# EAGLE design PCM2704_Test_v1B (EAGLE 6.4)
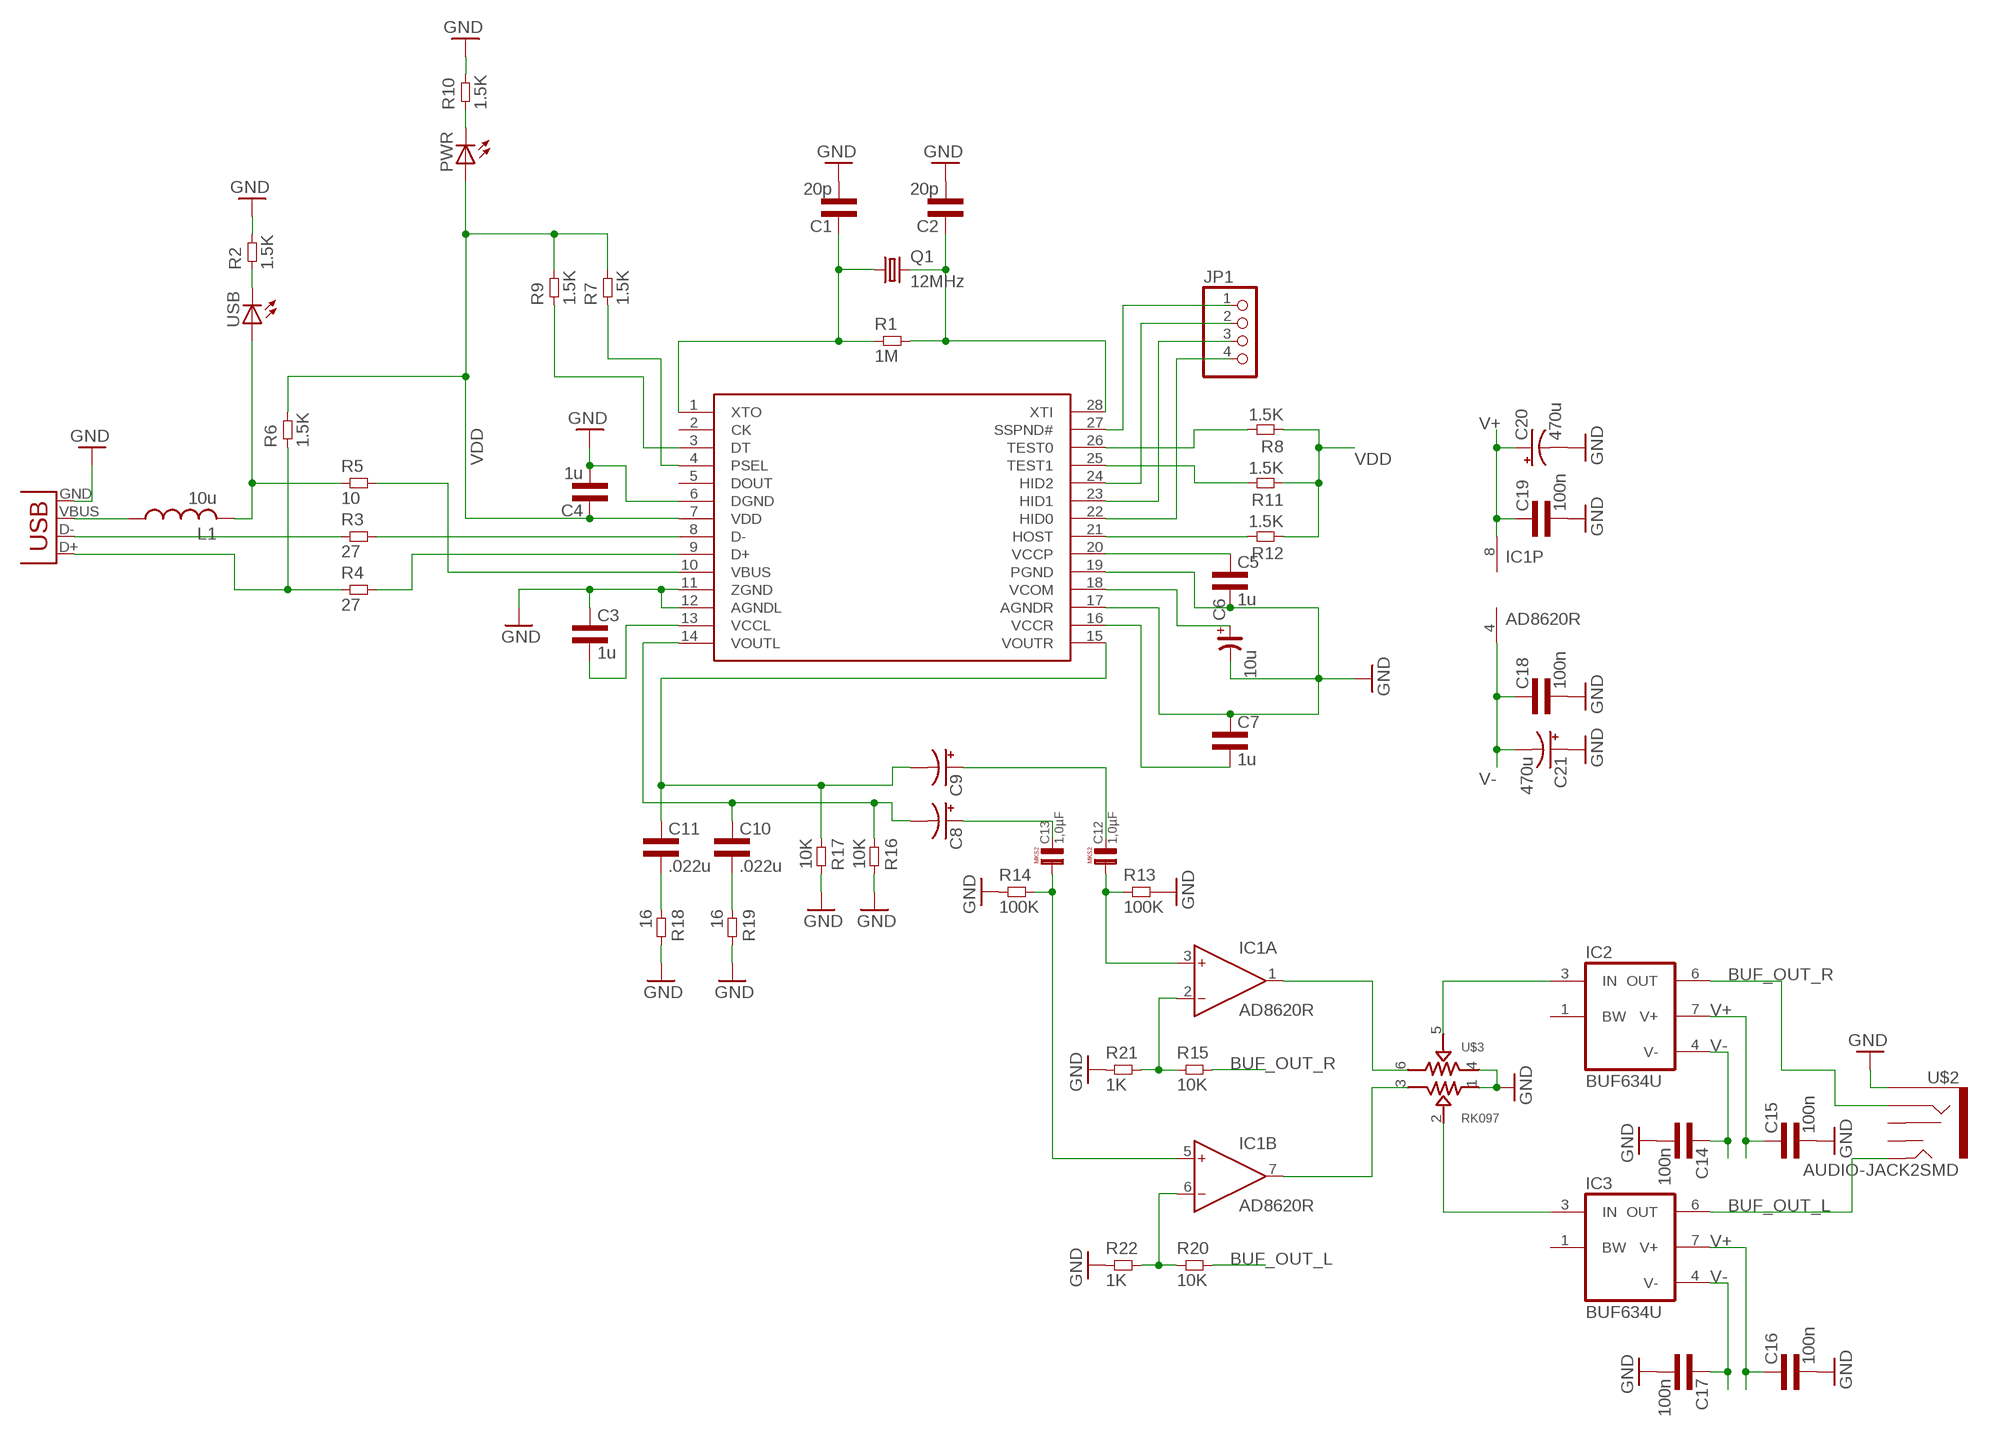
[diagram p0: schematic, sheet 1]

## Parts
C1  20p  CAP0603L3  [0603L3]
C2  20p  CAP0603L3  [0603L3]
C3  1u  CAP0603L3  [0603L3]
C4  1u  CAP0603L3  [0603L3]
C5  1u  CAP0603L3  [0603L3]
C6  10u  CP_E-010X030  [CE-010X030]
C7  1u  CAP0603L3  [0603L3]
C8  CPOL-USE1.8-4  [E1,8-4]
C9  CPOL-USE1.8-4  [E1,8-4]
C10  .022u  CAP0603L3  [0603L3]
C11  .022u  CAP0603L3  [0603L3]
C12  1,0µF  [R5B5]
C13  1,0µF  [R5B5]
C14  100n  CAP0603L3  [0603L3]
C15  100n  CAP0603L3  [0603L3]
C16  100n  CAP0603L3  [0603L3]
C17  100n  CAP0603L3  [0603L3]
C18  100n  CAP0603L3  [0603L3]
C19  100n  CAP0603L3  [0603L3]
C20  470u  CPOL-USE5-13  [E5-13]
C21  470u  CPOL-USE5-13  [E5-13]
IC1  AD8620R  [SO8]
IC2  BUF634U  [SO08]
IC3  BUF634U  [SO08]
JP1  PINHD-1X4  [1X04]
L1  10u  L-USL3225M  [L3225M]
PWR  LEDCHIP-LED0603  [CHIP-LED0603]
Q1  12MHz  CRYSTALHC49US  [HC49US]
R1  1M  RES0603L3  [0603L3]
R2  1.5K  RES0603L3  [0603L3]
R3  27  RES0603L3  [0603L3]
R4  27  RES0603L3  [0603L3]
R5  10  RES0805L3  [0805L3]
R6  1.5K  RES0603L3  [0603L3]
R7  1.5K  RES0603L3  [0603L3]
R8  1.5K  RES0603L3  [0603L3]
R9  1.5K  RES0603L3  [0603L3]
R10  1.5K  RES0603L3  [0603L3]
R11  1.5K  RES0603L3  [0603L3]
R12  1.5K  RES0603L3  [0603L3]
R13  100K  RES0603L3  [0603L3]
R14  100K  RES0603L3  [0603L3]
R15  10K  RES0603L3  [0603L3]
R16  10K  RES0603L3  [0603L3]
R17  10K  RES0603L3  [0603L3]
R18  16  RES0603L3  [0603L3]
R19  16  RES0603L3  [0603L3]
R20  10K  RES0603L3  [0603L3]
R21  1K  RES0603L3  [0603L3]
R22  1K  RES0603L3  [0603L3]
U$1  PCM2704C  [PCM2704C]
U$2  AUDIO-JACK2SMD  [AUDIO-JACK-3.5MM-SMD]
U$3  RK097  [RK097]
USB  LEDCHIP-LED0603  [CHIP-LED0603]
X1  USB-MB-S  [USB-MB-S]

## Nets
BUF_OUT_L: IC3.6(OUT) R20.P$2 U$2.TIP
BUF_OUT_R: IC2.6(OUT) R15.P$2 U$2.RING
GND: C1.P$2 C2.P$2 C3.P$1 C4.P$2 C5.P$2 C6.- C7.P$1 C14.P$2 C15.P$2 C16.P$2 C17.P$2 C18.P$2 C19.P$2 C20.- C21.+ R2.P$2 R10.P$2 R13.P$2 R14.P$1 R16.P$2 R17.P$2 R18.P$2 R19.P$2 R21.P$1 R22.P$1 U$1.6(DGND) U$1.11(ZGND) U$1.12(AGNDL) U$1.17(AGNDR) U$1.19(PGND) U$2.SLEEVE U$3.1 U$3.4 X1.GND
N$1: C1.P$1 Q1.1 R1.P$1 U$1.1(XTO)
N$2: C2.P$1 Q1.2 R1.P$2 U$1.28(XTI)
N$3: R3.P$2 U$1.8(D-)
N$4: C3.P$2 U$1.13(VCCL)
N$5: R8.P$2 U$1.26(TEST0)
N$6: R4.P$2 U$1.9(D+)
N$7: L1.2 R5.1 USB.A
N$8: R5.2 U$1.10(VBUS)
N$9: R11.P$2 U$1.25(TEST1)
N$10: C9.- C11.P$1 R17.P$1 U$1.15(VOUTR)
N$11: R12.P$2 U$1.21(HOST)
N$12: JP1.1 U$1.27(SSPND#)
N$13: C5.P$1 U$1.20(VCCP)
N$14: C6.+ U$1.18(VCOM)
N$15: C8.+ C13.2
N$16: R9.P$1 U$1.3(DT)
N$17: R2.P$1 USB.C
N$18: C9.+ C12.2
N$19: JP1.2 U$1.24(HID2)
N$20: JP1.3 U$1.23(HID1)
N$21: JP1.4 U$1.22(HID0)
N$22: PWR.C R10.P$1
N$23: C7.P$2 U$1.16(VCCR)
N$24: C8.- C10.P$1 R16.P$1 U$1.14(VOUTL)
N$25: C12.1 IC1.3(A:IN+) R13.P$1
N$26: C13.1 IC1.5(B:IN+) R14.P$2
N$27: C11.P$2 R18.P$1
N$28: C10.P$2 R19.P$1
N$29: IC1.2(A:IN-) R15.P$1 R21.P$2
N$30: IC1.6(B:IN-) R20.P$1 R22.P$2
N$31: IC2.3(IN) U$3.5
N$32: IC3.3(IN) U$3.2
N$33: IC1.1(A:OUT) U$3.6
N$34: IC1.7(B:OUT) U$3.3
PSEL: R7.P$1 U$1.4(PSEL)
USB_D_N: R3.P$1 X1.D-
USB_D_P: R4.P$1 R6.P$1 X1.D+
V+: C15.P$1 C16.P$1 C19.P$1 C20.+ IC1.8(P:V+) IC2.7(V+) IC3.7(V+)
V-: C14.P$1 C17.P$1 C18.P$1 C21.- IC1.4(P:V-) IC2.4(V-) IC3.4(V-)
VBUS_RAW: L1.1 X1.VBUS
VDD: C4.P$1 PWR.A R6.P$2 R7.P$2 R8.P$1 R9.P$2 R11.P$1 R12.P$1 U$1.7(VDD)
Unconnected: IC2.1(BW) IC3.1(BW) U$1.2(CK) U$1.5(DOUT) U$2.RSH U$2.TSH

## Library data of the parts
C1-C5 C7 C10 C11 C14-C19 = common:CAP
C6 = rc-master:CP_: POLARIZED CAP
C8 C9 C20 C21 = rcl:CPOL-US: POLARIZED CAPACITOR, American symbol
C12 C13 = Capacitor-Wima-MKS2-63v:1,0µF
IC1 = analog-devices:AD8620: Precision, Very Low Noise, Low Input Bias Current, Wide Bandwidth JFET Operational Amplifiers Source: http://www.analog.com/static/imported-files/data_sheets/AD8610_8620.pdf; MF: ALTERA CORPORATION; MPN: AD8620ARZ; OC_FARNELL: 9994386; OC_NEWARK: 59K6972
IC2 IC3 = burr-brown:BUF634: 250mA High-Speed Buffer; MF: TEXAS INSTRUMENTS; MPN: BUF634U; OC_FARNELL: 4733617; OC_NEWARK: 27C6567
JP1 = pinhead:PINHD-1X4: PIN HEADER
L1 = rcl:L-US: INDUCTOR, American symbol
PWR USB = adafruit:LED: LED OSRAM: - CHIPLED LG R971, LG N971, LY N971, LG Q971, LY Q971, LO R971, LY R971 LH N974, LH R974 LS Q976, LO Q976, LY Q976 LO Q996 - Hyper CHIPLED LW Q18S LB Q993, LB Q99A, LB R99A - SideLED LS A670, LO A670, LY A670, LG A670, LP A670 LB A673, LV A673, LT A673, LW A673 LH A674 LY A675 LS A676, LA A676, LO A676, LY A676, LW A676 LS A679, LY A679, LG A679 - Hyper Micro SIDELED® LS Y876, LA Y876, LO Y876, LY Y876 LT Y87S - SmartLED LW L88C, LW L88S LB L89C, LB L89S, LG L890 LS L89K, LO L89K, LY L89K LS L896, LA L896, LO L896, LY L896 - TOPLED LS T670, LO T670, LY T670, LG T670, LP T670 LSG T670, LSP T670, LSY T670, LOP T670, LYG T670 LG T671, LOG T671, LSG T671 LB T673, LV T673, LT T673, LW T673 LH T674 LS T676, LA T676, LO T676, LY T676, LB T676, LH T676, LSB T676, LW T676 LB T67C, LV T67C, LT T67C, LS T67K, LO T67K, LY T67K, LW E67C LS E67B, LA E67B, LO E67B, LY E67B, LB E67C, LV E67C, LT E67C LW T67C LS T679, LY T679, LG T679 LS T770, LO T770, LY T770, LG T770, LP T770 LB T773, LV T773, LT T773, LW T773 LH T774 LS E675, LA E675, LY E675, LS T675 LS T776, LA T776, LO T776, LY T776, LB T776 LHGB T686 LT T68C, LB T68C - Hyper Mini TOPLED® LB M676 - Mini TOPLED Santana® LG M470 LS M47K, LO M47K, LY M47K Source: http://www.osram.convergy.de/
Q1 = SparkFun-FreqCtrl:CRYSTAL: Various standard crystals. Proven footprints. Spark Fun Electronics SKU : COM-00534
R1-R22 = common:RES
U$1 = pcm2704c:PCM2704C
U$2 = SparkFun-Connectors:AUDIO-JACK2: Stereo audio jack with bypass switches. Used on LilyPad MP3 board. Production SKU: CONN-10353; PROD_ID: CONN-10353
U$3 = SparkFun-Electromechanical:RK097
X1 = con-usb:USB: USB Connectors

## Board
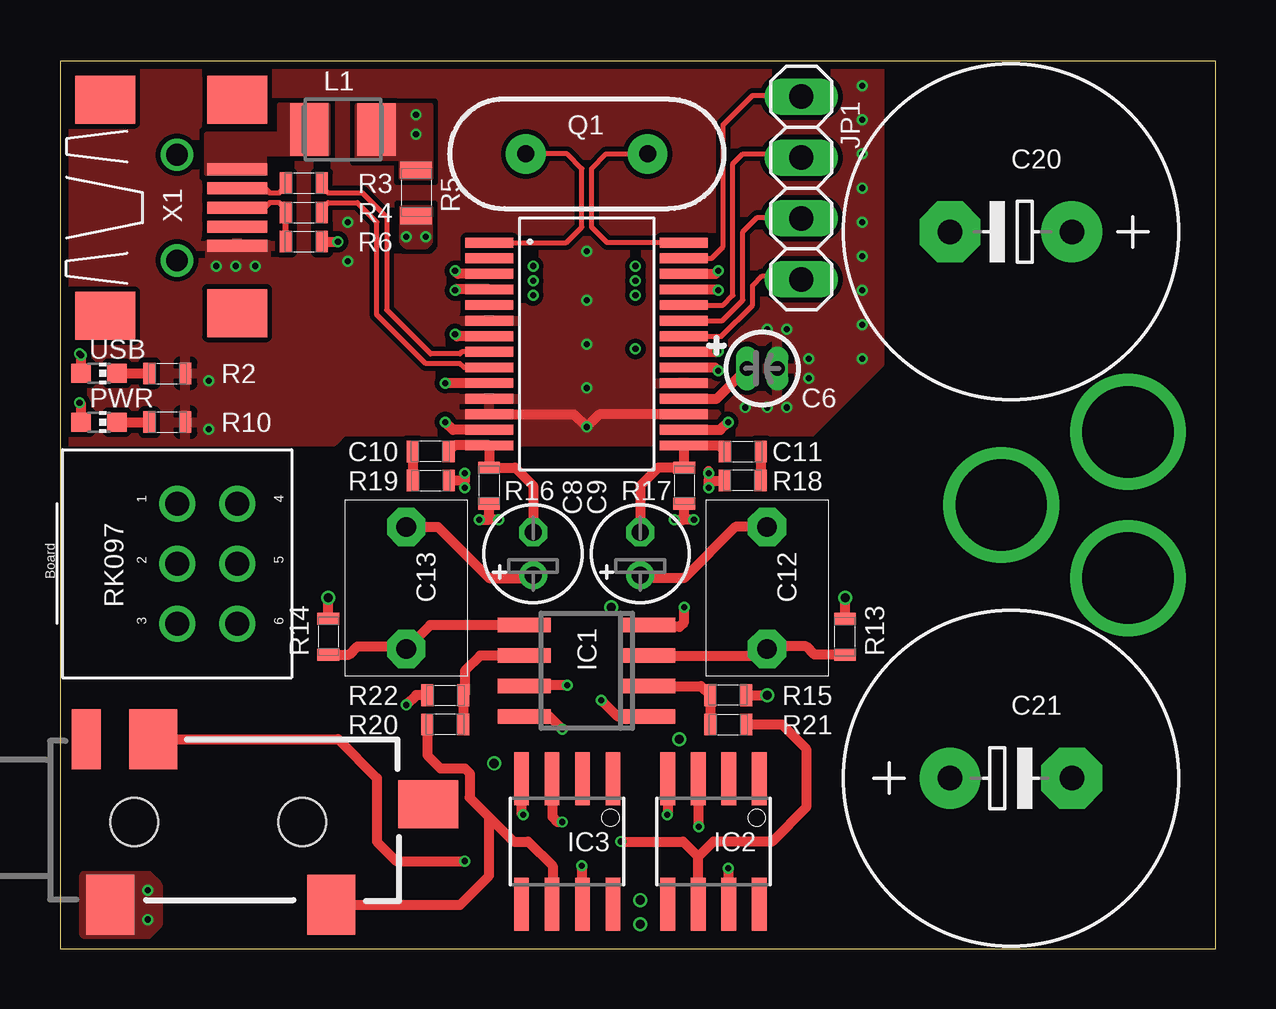
[diagram p1: board, top side]
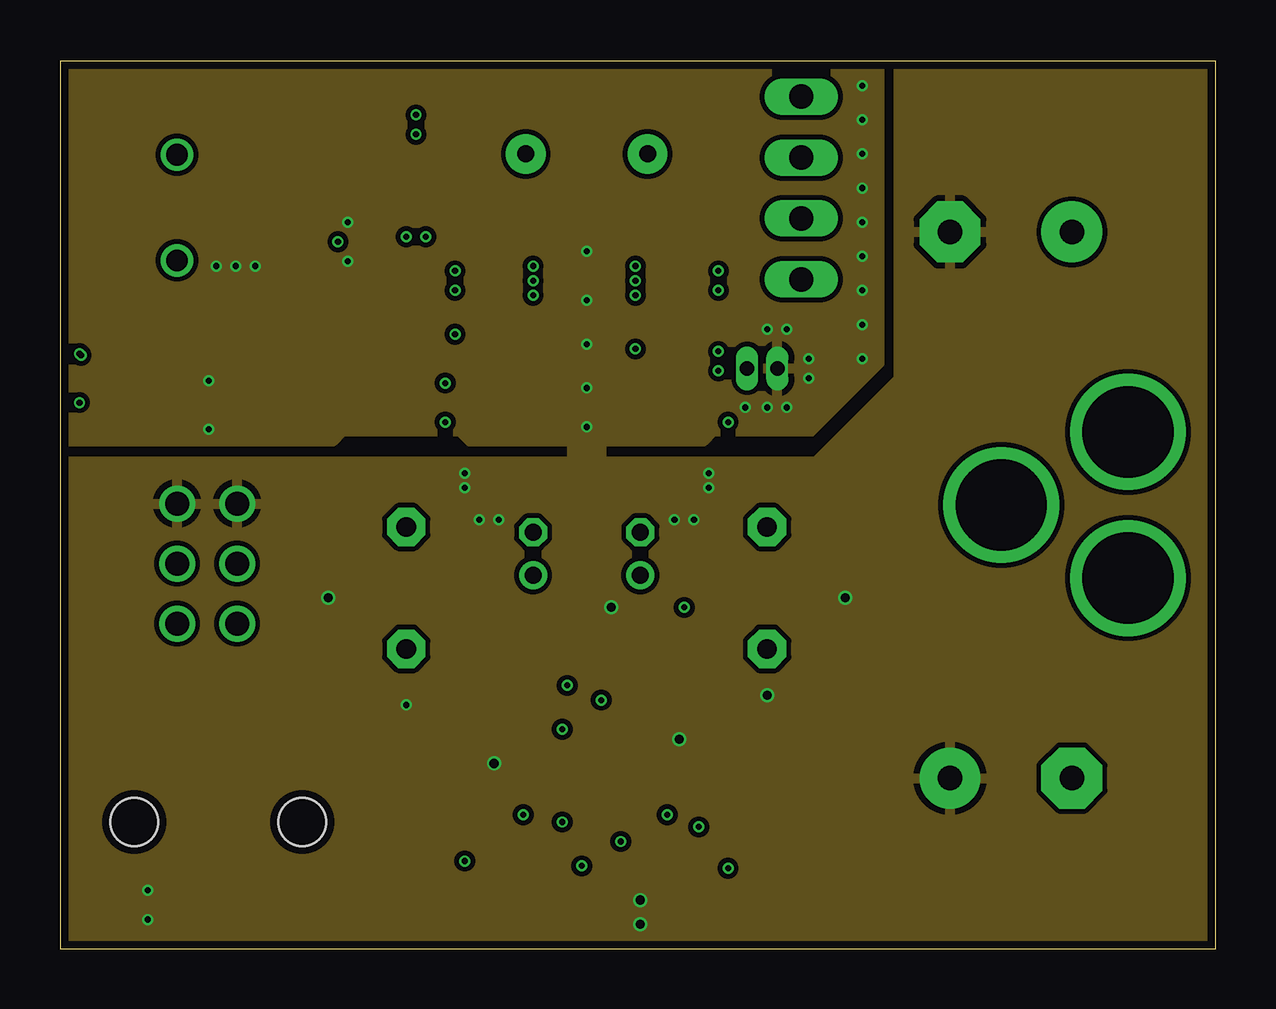
[diagram p2: board, inner layer Route2]
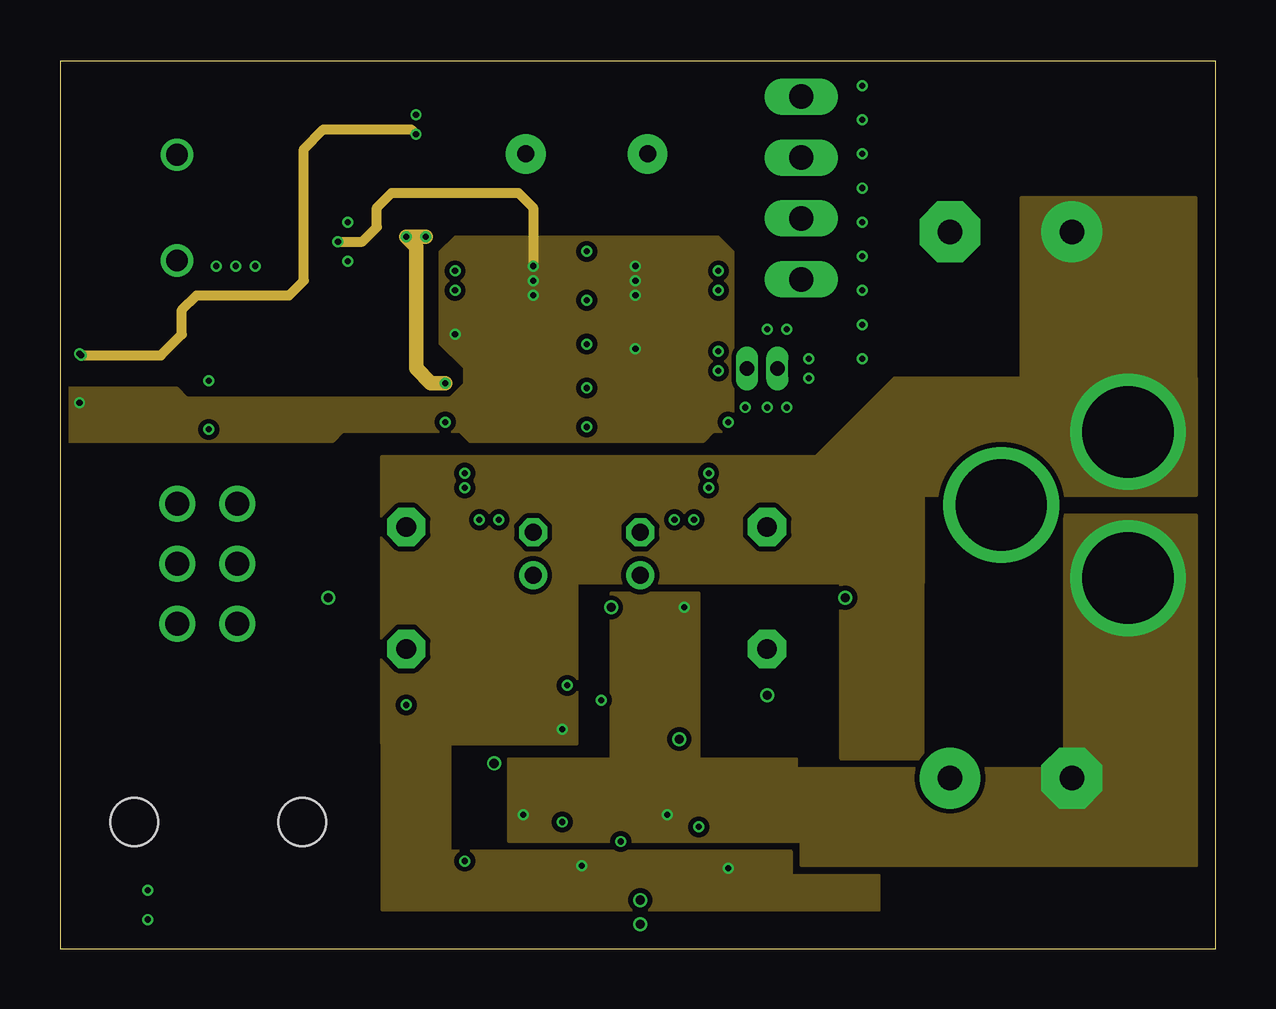
[diagram p3: board, inner layer Route3]
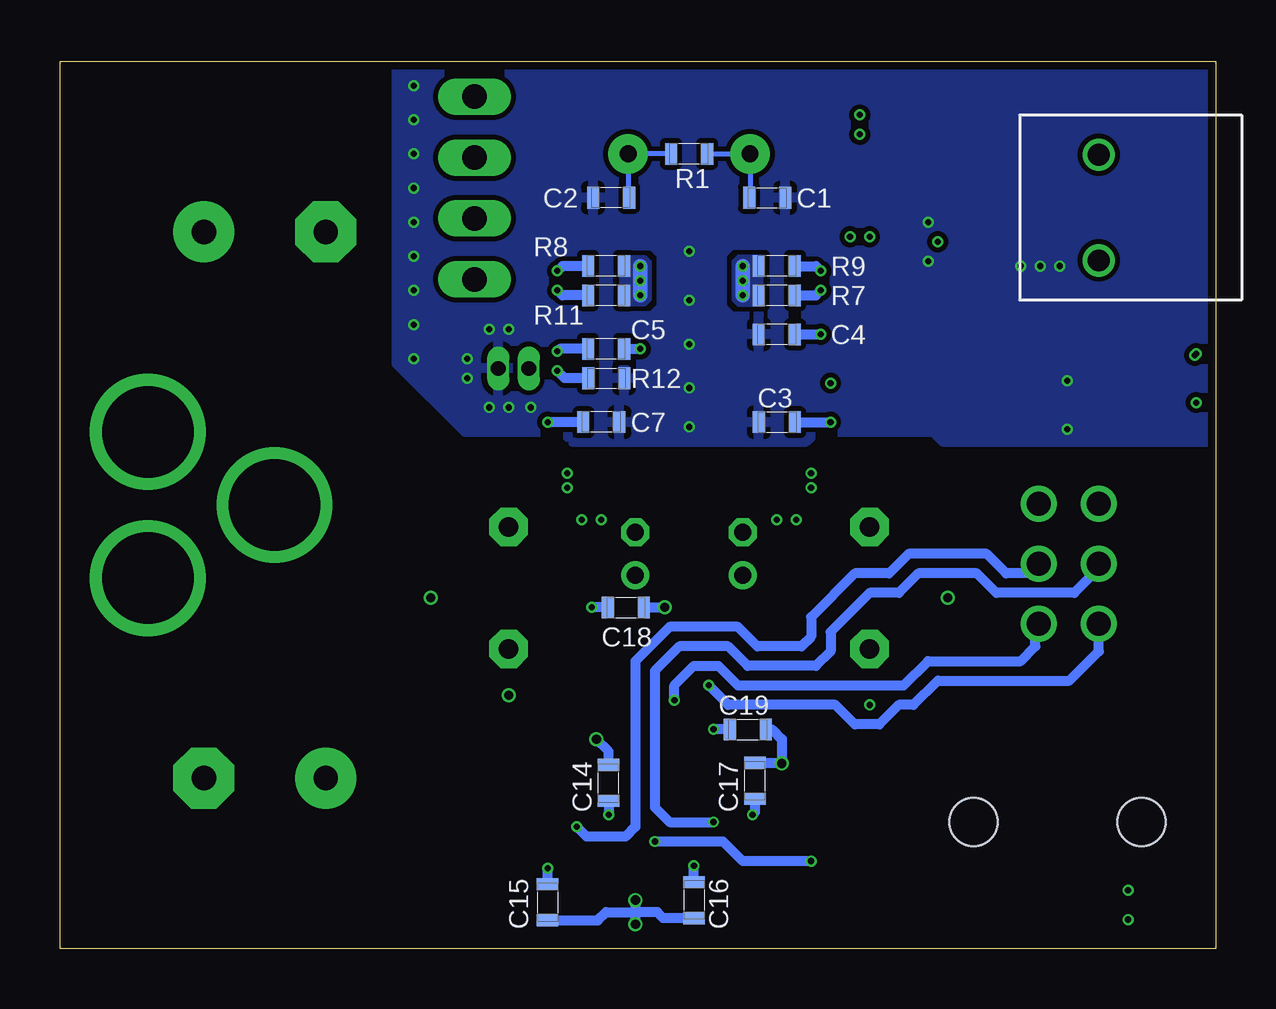
[diagram p4: board, bottom side, seen from below]

Size 48.16 x 36.98 mm. Coordinates in mm from the lower left corner, seen from the top.
Outline: 0,0 48.16,0 48.16,36.98 0,36.98 0,0
Copper layers (1*2*3*16): Top 0.035mm / dielectric 1.5mm / Route2 0.035mm / dielectric 0.15mm / Route3 0.035mm / dielectric 0.2mm / Bottom 0.035mm
Design rules "default *": minimum track width 5mil, minimum drill 10mil, track to track 8mil, track to pad 8mil, pad to pad 8mil, via to via 8mil, smd to smd 8mil, copper to edge 13mil, drill to drill 8mil, minimum pad ring 4mil, minimum via ring 4mil, stop-mask expansion 2mil, vias tented up to drill 13mil, thermal gap 10mil

### Footprints (pad centres in the part's own frame; a part is rotated, then mirrored left to right if it is on the bottom)
0603L3 = smd 0.5 x 0.9: P$1 -0.75,0; P$2 0.75,0
CE-010X030 = drill 0.61 pad 0.813 long: + -0.635,0; - 0.635,0
E1,8-4 = drill 0.711 pad 1.168: + -0.889,0 | drill 0.711 pad 1.168 octagon: - 0.889,0
R5B5 = drill 0.813 pad 1.6 octagon: 1 -2.54,0; 2 2.54,0
E5-13 = drill 1.016 pad 2.54: + -2.54,0 | drill 1.016 pad 2.54 octagon: - 2.54,0
SO8 = smd 0.6 x 2.2: 1 -1.905,-2.6; 2 -0.635,-2.6; 3 0.635,-2.6; 4 1.905,-2.6; 5 1.905,2.6; 6 0.635,2.6; 7 -0.635,2.6; 8 -1.905,2.6
SO08 = smd 0.61 x 2.21: 1 -1.905,-2.616; 2 -0.635,-2.616; 3 0.635,-2.616; 4 1.905,-2.616; 5 1.905,2.616; 6 0.635,2.616; 7 -0.635,2.616; 8 -1.905,2.616
1X04 = drill 1.016 long: 1 -3.81,0; 2 -1.27,0; 3 1.27,0; 4 3.81,0
L3225M = smd 1.6 x 2.2: 1 -1.4,0; 2 1.4,0
CHIP-LED0603 = smd 0.8 x 0.8: A 0,-0.75; C 0,0.75
HC49US = drill 0.7 pad 1.651: 1 -2.54,0; 2 2.54,0
0805L3 = smd 0.7 x 1.3: 1 -0.95,0; 2 0.95,0
PCM2704C = smd 0.41 x 2: 1 -4.225,-4.05; 2 -3.575,-4.05; 3 -2.925,-4.05; 4 -2.275,-4.05; 5 -1.625,-4.05; 6 -0.975,-4.05; 7 -0.325,-4.05; 8 0.325,-4.05; 9 0.975,-4.05; 10 1.625,-4.05; 11 2.275,-4.05; 12 2.925,-4.05; 13 3.575,-4.05; 14 4.225,-4.05; 15 4.225,4.05; 16 3.575,4.05; 17 2.925,4.05; 18 2.275,4.05; 19 1.625,4.05; 20 0.975,4.05; 21 0.325,4.05; 22 -0.325,4.05; 23 -0.975,4.05; 24 -1.625,4.05; 25 -2.275,4.05; 26 -2.925,4.05; 27 -3.575,4.05; 28 -4.225,4.05
AUDIO-JACK-3.5MM-SMD = smd 2 x 2.5: RING 4.3,3.45; SLEEVE 2.5,-3.45; TIP 11.7,-3.45 | smd 1.2 x 2.5: RSH 1.5,3.45 | smd 2.5 x 2: TSH 15.75,0.75 | hole 2: 3.5,0; 10.5,0
RK097 = drill 1: 1 2.5,0; 2 0,0; 3 -2.5,0; 4 2.5,-2.5; 5 0,-2.5; 6 -2.5,-2.5
USB-MB-S = smd 2.5 x 0.5: D+ 2.5,0; D- 2.5,0.8; GND 2.5,-1.6; ID 2.5,-0.8; VBUS 2.5,1.6 | smd 2.5 x 2: P$1 -3,-4.5; P$2 -3,4.5; P$3 2.5,-4.4; P$4 2.5,4.5 | drill 0.9: P$5 0,2.2; P$6 0,-2.2

### Placement (x,y rotation side)
C1  18.69,31.29 0 bottom
C2  25.2,31.29 180 bottom
C3  18.29,21.95 0 bottom
C4  18.29,25.6 180 bottom
C5  25.4,23.77 0 bottom
C6  29.26,24.18 0 top
C7  25.6,21.95 180 bottom
C8  19.71,16.46 90 top
C9  24.18,16.46 90 top
C10  15.44,20.73 180 top
C11  28.45,20.73 0 top
C12  29.46,15.04 90 top
C13  14.43,15.04 90 top
C14  25.3,6.91 90 bottom
C15  27.84,1.93 270 bottom
C16  21.74,2.03 270 bottom
C17  19.2,7.01 90 bottom
C18  24.59,14.22 0 bottom
C19  19.51,9.14 0 bottom
C20  39.62,29.87 180 top
C21  39.62,7.11 0 top
IC1  21.95,11.58 90 top
IC2  27.23,4.47 180 top
IC3  21.13,4.47 180 top
JP1  30.89,31.7 270 top
L1  11.79,34.14 0 top
PWR  1.63,21.95 270 top
Q1  21.95,33.12 0 top
R1  21.95,33.12 180 bottom
R2  4.47,23.98 0 top
R3  10.16,31.9 0 top
R4  10.16,30.68 0 top
R5  14.83,31.5 270 top
R6  10.16,29.46 0 top
R7  18.29,27.23 180 bottom
R8  25.4,28.45 180 bottom
R9  18.29,28.45 180 bottom
R10  4.47,21.95 0 top
R11  25.4,27.23 180 bottom
R12  25.4,24.99 180 bottom
R13  32.72,13 90 top
R14  11.18,13 270 top
R15  27.84,9.35 0 top
R16  17.88,19.3 270 top
R17  26.01,19.3 270 top
R18  28.45,19.51 180 top
R19  15.44,19.51 0 top
R20  16.05,9.35 180 top
R21  27.84,10.57 180 top
R22  16.05,10.57 0 top
U$1  21.95,25.2 270 top
U$2  -0.41,5.28 0 top
U$3  4.88,16.05 90 top
USB  1.63,23.98 270 top
X1  4.88,30.89 0 top

### Tracks (layer width: path | path; a pad name or v marks a point on that pad's centre or on a via)
BUF_OUT_L
  Top 0.406: R20.P$2 15.3,8.07 15.85,7.52 16.87,7.52 17.07,7.32 17.07,6.3 17.88,5.49 | 17.88,5.49 18.9,4.47 19.51,4.47 20.52,3.45 20.52,1.88 IC3.6 | U$2.TIP 16.67,1.83 17.88,3.05 17.88,5.49
BUF_OUT_R  (via drill 0.25)
  Top 0.406: R15.P$2 30.07,9.35 31.09,8.33 31.09,5.89 29.67,4.47 27.23,4.47 26.59,3.84 | IC2.6 26.59,3.84 | U$2.RING 11.59,8.73 13.21,7.11 13.21,4.47 14.02,3.66 v16.87,3.66 | v23.37,4.47 25.96,4.47 26.59,3.84
  Bottom 0.406: v16.87,3.66 19.71,3.66 20.52,4.47 v23.37,4.47
GND  (via drill 0.25, 0.38)
  Top 0.406: U$1.12 21.42,22.27 v21.95,21.74 22.48,22.27 U$1.17 | R22.P$1 14.83,10.57 v14.43,10.16 | v17.48,17.88 17.88,17.88 | v18.29,17.88 17.88,17.88 | 17.88,17.88 R16.P$2 | v25.6,17.88 26.01,17.88 | v26.42,17.88 26.01,17.88 | 26.01,17.88 R17.P$2 | v16.87,19.81 16.87,19.51 | 16.87,19.3 16.87,19.51 | 16.87,19.51 R19.P$2 | v27.03,19.2 27.03,19.51 | 27.03,19.91 27.03,19.51 | 27.03,19.51 R18.P$2 | R14.P$1 v11.18,14.63 | R13.P$2 v32.72,14.63 | R21.P$1 v29.46,10.57
  Bottom 0.406: v24.18,2.03 24.18,1.52 | 24.18,1.52 v24.18,1.02 | C16.P$2 23.02,1.28 23.27,1.52 24.18,1.52 | C15.P$2 25.74,1.18 25.4,1.52 24.18,1.52 | C18.P$2 v22.96,14.22 | C17.P$2 18.12,7.76 v18.09,7.72 18.09,8.74 18.49,9.14 C19.P$2 | C14.P$2 25.3,8.23 v25.81,8.74
  other vias: 6.5,28.45 7.32,28.45 8.13,28.45 11.99,28.65 6.2,23.67 6.2,21.64 28.55,22.56 31.19,24.59 29.46,25.81 30.28,25.81 31.19,23.77 30.28,22.56 29.46,22.56 11.99,30.28 33.43,35.97 33.43,34.54 33.43,33.12 33.43,31.7 33.43,30.28 33.43,28.85 33.43,27.43 33.43,26.01 33.43,24.59 21.95,29.06 21.95,25.2 21.95,27.03 21.95,23.37 16.87,19.2 27.03,19.81 3.66,1.22 3.66,2.44
  pour Route2: 0.2,36.78 34.14,36.78 34.14,24.38 31.29,21.54 27.23,21.54 26.82,21.13 17.07,21.13 16.66,21.54 11.79,21.54 11.38,21.13 0.2,21.13
  pour Top (rank 6): 0.2,36.78 34.14,36.78 34.14,24.38 31.29,21.54 27.23,21.54 26.82,21.13 17.07,21.13 16.66,21.54 11.79,21.54 11.38,21.13 0.2,21.13
  pour Bottom (rank 6): 0.2,36.78 34.14,36.78 34.14,24.38 31.29,21.54 27.23,21.54 26.82,21.13 17.07,21.13 16.66,21.54 11.79,21.54 11.38,21.13 0.2,21.13
  pour Top (no thermals): 6.1,29.46 6.1,28.24 6.3,28.04 8.53,28.04 8.74,28.24 8.74,29.46
  pour Route2: 0.2,20.32 21.34,20.32 21.34,22.15 22.56,22.15 22.56,20.32 31.5,20.32 34.95,23.77 34.95,36.78 47.96,36.78 47.96,0.2 0.2,0.2
  pour Top (no thermals): 1.22,3.05 3.66,3.05 4.06,2.64 4.06,1.02 3.66,0.61 1.02,0.61 1.02,3.05
N$1
  Top 0.203: U$1.1 21.09,29.42 21.74,30.07 21.74,32.51 21.13,33.12 Q1.1
  Bottom 0.203: R1.P$1 Q1.1 19.41,31.33 C1.P$1
N$2
  Top 0.203: U$1.28 22.8,29.42 22.15,30.07 22.15,32.51 22.76,33.12 Q1.2
  Bottom 0.203: R1.P$2 Q1.2 24.49,31.33 C2.P$1
N$3
  Top 0.203: R3.P$2 10.91,31.76 11.18,31.5 12.6,31.5 13.61,30.48 13.61,26.62 15.44,24.79 16.66,24.79 16.74,24.87 U$1.8
N$4  (via drill 0.25)
  Top 0.406: U$1.13 16.38,21.62 v16.05,21.95
  Bottom 0.406: C3.P$2 v16.05,21.95
N$5  (via drill 0.25)
  Top 0.406: U$1.26 27.31,28.12 v27.43,28.24
  Bottom 0.406: R8.P$2 27.23,28.45 v27.43,28.24
N$6
  Top 0.203: U$1.9 16.82,24.22 16.66,24.38 15.24,24.38 13.21,26.42 13.21,30.28 12.4,31.09 11.18,31.09 10.91,30.82 R4.P$2
N$7  (via drill 0.25)
  Top 0.406: USB.A v0.88,24.73 v0.81,24.79
  Route3 0.406: v0.88,24.73 4.2,24.73 5.08,25.6 5.08,26.62 5.69,27.23 9.55,27.23 10.16,27.84 10.16,33.32 10.97,34.14 14.63,34.14 v14.83,33.93
  other vias: 14.83,34.75
  pour Top (no thermals): 12.4,35.15 15.44,35.15 15.44,32.11 14.22,32.11 14.22,32.92 12.4,32.92
N$8  (via drill 0.25)
  Top 0.406: U$1.10 v16.05,23.57
  Route3 0.61: v15.24,29.67 v14.43,29.67 14.83,29.26 14.83,24.18 15.44,23.57 v16.05,23.57
  pour Top (no thermals): 14.22,30.89 14.22,29.46 14.43,29.26 15.24,29.26 15.44,29.46 15.44,30.89
N$9  (via drill 0.25)
  Top 0.406: U$1.25 27.39,27.47 v27.43,27.43
  Bottom 0.406: R11.P$2 27.23,27.23 v27.43,27.43
N$10
  Top 0.406: C11.P$1 27.45,20.97 U$1.15 26,20.07 R17.P$1 24.93,20.05 24.18,19.3 C9.-
N$11  (via drill 0.25)
  Top 0.406: U$1.21 27.41,24.87 v27.43,24.89
  Bottom 0.406: R12.P$2 27.33,24.99 v27.43,24.89
N$12
  Top 0.203: U$1.27 27.15,28.77 27.64,29.26 27.64,34.34 28.85,35.56 30.84,35.56 JP1.1
N$13  (via drill 0.25)
  Top 0.406: U$1.20 27.29,24.22 v27.43,24.08
  Bottom 0.406: C5.P$1 27.13,23.77 v27.43,24.08
N$14
  Top 0.406: U$1.18 27.37,22.92 C6.+
N$15
  Top 0.406: C13.2 15.75,17.58 17.88,15.44 19.58,15.44 C8.+
N$16  (via drill 0.25)
  Top 0.406: U$1.3 16.58,28.12 v16.46,28.24
  Bottom 0.406: R9.P$1 16.66,28.45 v16.46,28.24
N$17
  Top 0.406: USB.C R2.P$1
N$18
  Top 0.406: C12.2 28.14,17.58 26.01,15.44 24.31,15.44 C9.+
N$19
  Top 0.203: U$1.24 27.63,26.82 28.04,27.23 28.04,32.71 28.45,33.12 30.73,33.12 JP1.2
N$20
  Top 0.203: U$1.23 27.59,26.17 28.45,27.03 28.45,29.87 29.06,30.48 30.84,30.48 JP1.3
N$21
  Top 0.203: U$1.22 27.55,25.52 28.85,26.82 28.85,27.63 29.26,28.04 30.73,28.04 JP1.4
N$22
  Top 0.406: PWR.C R10.P$1
N$23  (via drill 0.25)
  Top 0.406: U$1.16 27.51,21.62 v27.84,21.95
  Bottom 0.406: C7.P$2 v27.84,21.95
N$24
  Top 0.406: C10.P$1 16.44,20.97 U$1.14 17.9,20.07 R16.P$1 18.96,20.05 19.71,19.3 C8.-
N$25
  Top 0.406: IC1.3 29.18,12.22 C12.1 29.57,12.6 31.09,12.6 31.43,12.26 R13.P$1
N$26
  Top 0.406: IC1.5 15.42,13.49 C13.1 14.33,12.6 12.4,12.6 12.05,12.26 R14.P$2
N$27
  Top 0.406: C11.P$2 R18.P$1
N$28
  Top 0.406: C10.P$2 R19.P$1
N$29
  Top 0.406: IC1.2 26.71,10.95 R21.P$2 R15.P$1
N$30
  Top 0.406: IC1.6 17.5,12.22 16.87,11.58 16.87,10.63 R22.P$2 R20.P$1
N$31  (via drill 0.25)
  Top 0.406: v26.62,5.08 26.62,7.06 IC2.3
  Bottom 0.406: U$3.5 7.38,15.99 7.72,15.65 8.74,15.65 9.55,16.46 12.8,16.46 13.61,15.65 15.04,15.65 16.87,13.82 16.87,13.01 17.27,12.6 19.1,12.6 19.91,13.41 22.76,13.41 24.18,11.99 24.18,5.08 24.59,4.67 26.21,4.67 v26.62,5.08
N$32  (via drill 0.25)
  Top 0.406: v20.93,5.28 20.73,5.28 20.52,5.49 20.52,7.06 IC3.3
  Bottom 0.406: U$3.2 4.88,15.85 5.89,14.83 9.14,14.83 9.96,15.65 12.4,15.65 13.21,14.83 14.43,14.83 16.05,13.21 16.05,12.4 16.66,11.79 19.51,11.79 20.32,12.6 22.35,12.6 23.37,11.58 23.37,5.89 22.76,5.28 v20.93,5.28
N$33  (via drill 0.25)
  Top 0.406: IC1.1 23.24,9.68 v22.56,10.36
  Bottom 0.406: v22.56,10.36 22.56,10.97 21.74,11.79 20.73,11.79 19.91,10.97 13.01,10.97 11.99,11.99 8.13,11.99 7.52,12.6 7.52,13.41 U$3.6
N$34  (via drill 0.25)
  Top 0.406: v21.13,10.97 19.37,10.97 IC1.7
  Bottom 0.406: v21.13,10.97 20.32,10.16 15.85,10.16 15.04,9.35 14.02,9.35 13.21,10.16 12.6,10.16 11.58,11.18 6.1,11.18 4.88,12.4 U$3.3
N$50  (via drill 3.81)
  other vias: 39.22,18.49
PSEL  (via drill 0.25)
  Top 0.406: U$1.4 16.5,27.47 v16.46,27.43
  Bottom 0.406: R7.P$1 16.66,27.23 v16.46,27.43
USB_D_N
  Top 0.203: R3.P$1 9.41,31.76 9.14,31.5 8.74,31.5 8.55,31.69 X1.D-
USB_D_P
  Top 0.203: X1.D+ 8.53,30.89 8.74,31.09 9.14,31.09 9.41,30.82 R4.P$1
  Top 0.254: R6.P$1 R4.P$1
V+  (via drill 0.25, 3.81)
  Top 0.406: IC2.7 27.86,3.33 v27.84,3.35 | IC1.8 20.4,9.68 v20.93,9.14 | IC3.7 21.77,3.43 v21.74,3.45
  Bottom 0.406: C15.P$1 v27.84,3.35 | C19.P$1 v20.93,9.14 | C16.P$1 v21.74,3.45
  other vias: 44.5,21.54
  pour Route3 (no thermals): 21.54,9.96 13.41,9.96 13.41,1.63 34.14,1.63 34.14,3.05 30.48,3.05 30.48,4.06 16.26,4.06 16.26,8.13 16.26,8.53 21.54,8.53
  pour Route3 (no thermals): 47.35,18.9 47.35,31.29 40.03,31.29 40.03,23.77 34.75,23.77 32.51,21.54 32.51,7.92 35.97,7.92 35.97,18.9
  pour Route3 (no thermals): 21.54,8.53 13.41,8.53 13.41,20.52 31.5,20.52 34.75,23.77 47.35,23.77 47.35,18.9 35.97,18.9 35.97,15.24 21.54,15.24
V-  (via drill 0.25, 3.81)
  Top 0.406: IC2.4 25.32,5.61 v25.3,5.59 | IC3.4 19.23,5.66 v19.3,5.59 | IC1.4 24.62,13.41 25.81,13.41 26.01,13.61 v26.01,14.22
  Bottom 0.406: C14.P$1 v25.3,5.59 | C17.P$1 19.2,5.69 v19.3,5.59 | C18.P$1 v26.01,14.22
  other vias: 44.5,15.44
  pour Route3 (no thermals): 18.69,7.92 22.96,7.92 22.96,14.83 26.62,14.83 26.62,7.92 30.68,7.92 30.68,7.52 41.86,7.52 41.86,18.08 47.35,18.08 47.35,3.45 30.89,3.45 30.89,4.47 18.69,4.47
VBUS_RAW
  pour Top (no thermals): 11.18,35.15 9.14,35.15 9.14,33.93 6.1,33.93 6.1,32.31 8.53,32.31 8.53,33.12 11.18,33.12
VDD  (via drill 0.25)
  Top 0.406: U$1.7 16.54,25.52 v16.46,25.6 | R6.P$2 v11.58,29.46 | PWR.A 0.88,22.7 v0.81,22.76
  Route3 0.406: v11.58,29.46 12.6,29.46 13.21,30.07 13.21,30.89 13.82,31.5 19.1,31.5 19.71,30.89 v19.71,28.45
  Bottom 0.406: C4.P$1 v16.46,25.6 | R12.P$1 v23.98,24.99
  Bottom 0.61: v19.71,27.23 v19.71,27.84 v19.71,28.45 | v23.98,28.45 v23.98,27.84 v23.98,27.23
  pour Bottom (no thermals): 18.9,28.85 19.91,28.85 20.12,28.65 20.12,27.03 19.91,26.82 18.9,26.82
  pour Bottom (no thermals): 24.59,28.85 23.77,28.85 23.57,28.65 23.57,27.03 23.77,26.82 24.79,26.82 24.79,28.85
  pour Route3 (no thermals): 15.85,28.45 15.85,29.06 16.46,29.67 27.43,29.67 28.04,29.06 28.04,21.54 27.23,21.54 26.82,21.13 17.07,21.13 16.66,21.54 11.79,21.54 11.38,21.13 0.2,21.13 0.2,23.37 4.88,23.37 5.28,22.96 16.26,22.96 16.87,23.57 16.87,24.18 15.85,25.2